# Altium schematic sheet POWER_STAGE.SchDoc: Power
size 420 x 297 mm; Author: G.Kasprowicz; CompanyName: WUT ISE; DrawnBy: G.Kasprowicz; Organization: WUT ISE; Address1: PW ISE; Address2: Nowowiejska 15/19 00-665 Warsaw; Address3: gkasprow@gmail.com; DocumentNumber: 8; Revision: 2; SheetNumber: 8; SheetTotal: 10; ModifiedBy: -; CheckedDate: -; Title2: Stage; DivGrp: WUT ISE; Designer: G.Kasprowicz; ModifiedDate: -; ProjectName: Sensor Box
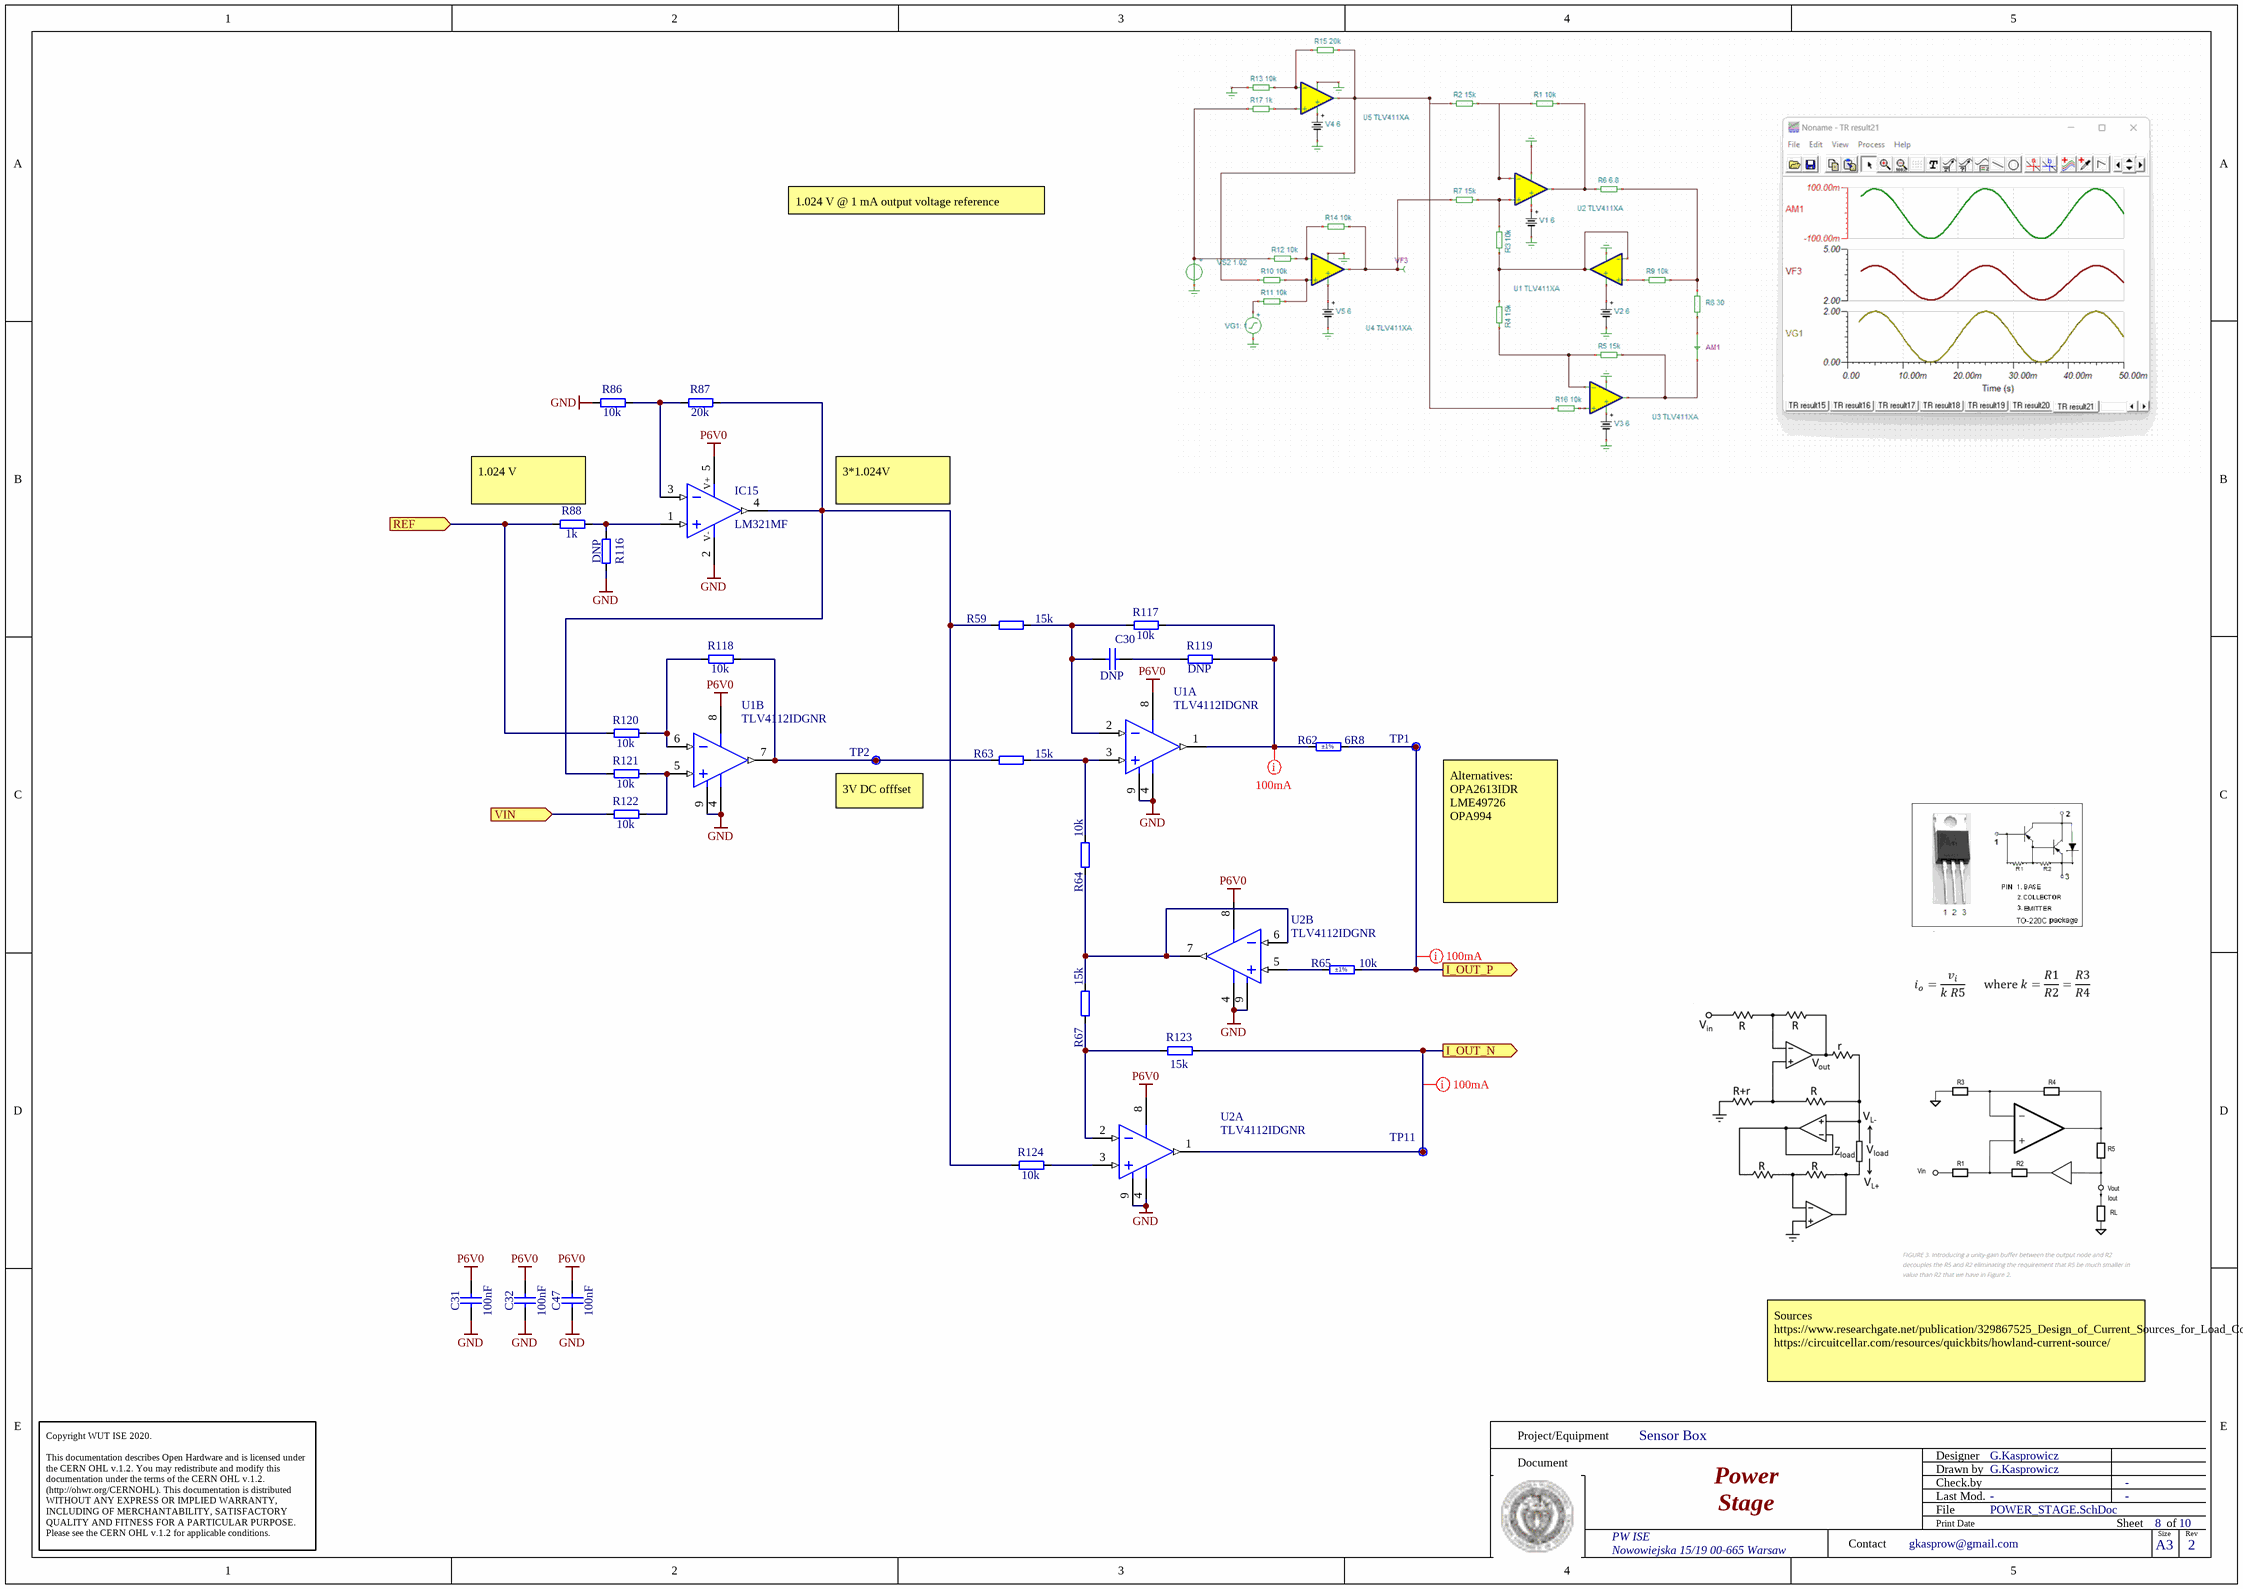
[diagram p0: POWER_STAGE.SchDoc]

## Parts
C30  DNP  [CAPC1005X55N]
C31  100nF  [CAPC1005X55N]
C32  100nF  [CAPC1005X55N]
C47  100nF  [CAPC1005X55N]
IC15  LM321MF  [SOT95P280X145-5N]
R59  15k  [RESC1005X40N]
R62  6R8  Tolerance: ±1%  [RESC6331X70N]
R63  15k  [RESC1005X40N]
R64  10k  [RESC1005X40N]
R65  10k  Tolerance: ±1%  [RESC1005X40N]
R67  15k  [RESC1005X40N]
R86  10k  [RESC1005X40N]
R87  20k  [RESC1005X40N]
R88  1k  [RESC1005X40N]
R116  DNP  [RESC1005X40N]
R117  10k  [RESC1005X40N]
R118  10k  [RESC1005X40N]
R119  DNP  [RESC1005X40N]
R120  10k  [RESC1005X40N]
R121  10k  [RESC1005X40N]
R122  10k  [RESC1005X40N]
R123  15k  [RESC1005X40N]
R124  10k  [RESC1005X40N]
TP1  Plated Hole  [c130h60]  (value not drawn)  (no BOM)
TP2  Plated Hole  [c130h60]  (value not drawn)  (no BOM)
TP11  Plated Hole  [c130h60]  (value not drawn)  (no BOM)
U1  TLV4112IDGNR  [DGN0008D_N]  (parts A,B of 2)
U2  TLV4112IDGNR  [DGN0008D_N]  (parts A,B of 2)

## Ports
I_OUT_N (out), I_OUT_P (out), REF (in), VIN (in)

## Nets
GND: C31.1 C32.1 C47.1 IC15.2(V-) R86.1 R116.2 U1.4(GND) U1.9(EP) U2.4(GND) U2.9(EP)
P6V0: C31.2 C32.2 C47.2 IC15.5(V+) U1.8(VDD+) U2.8(VDD+)
I_OUT_N: R123.2 TP11.1 U2.1(OUT1) ; port I_OUT_N
I_OUT_P: R62.2 R65.2 TP1.1 ; port I_OUT_P
REF: R88.1 R120.1 ; port REF
VIN: R122.1 ; port VIN
NetC30_1: C30.1 R59.2 R117.1 U1.2(IN1-)
NetC30_2: C30.2 R119.1
NetIC15_1: IC15.1(IN+) R88.2 R116.1
NetIC15_3: IC15.3(IN-) R86.2 R87.1
NetIC15_4: IC15.4(OUT) R59.1 R87.2 R121.1 R124.1
NetR62_1: R62.1 R117.2 R119.2 U1.1(OUT1)
NetR63_1: R63.1 R118.2 TP2.1 U1.7(OUT2)
NetR63_2: R63.2 R64.1 U1.3(IN1+)
NetR64_2: R64.2 R67.2 U2.6(IN2-) U2.7(OUT2)
NetR65_1: R65.1 U2.5(IN2+)
NetR67_1: R67.1 R123.1 U2.2(IN1-)
NetR118_1: R118.1 R120.2 U1.6(IN2-)
NetR121_2: R121.2 R122.2 U1.5(IN2+)
NetR124_2: R124.2 U2.3(IN1+)

## Layout directives
mark named 100mA: I_OUT_N, I_OUT_P, NetR62_1

## Notes on the sheet
- 1.024 V @ 1 mA output voltage reference
- (near R88) 1.024 V
- 3*1.024V
- (near TP2) 3V DC offfset
- (near TP1) Alternatives:
  OPA2613IDR
  LME49726
  OPA994
- Sources https://www.researchgate.net/publication/329867525_Design_of_Current_Sources_for_Load_Common_Mode_Optimization/figures?lo=1
  https://circuitcellar.com/resources/quickbits/howland-current-source/
- Project/Equipment
- Document
- Designer
- Drawn by
- Check.by
- Copyright WUT ISE 2020.
  This documentation describes Open Hardware and is licensed under the CERN OHL v.1.2. You may redistribute and modify this documentation under the terms of the CERN OHL v.1.2. (http://ohwr.org/CERNOHL). This documentation is distributed WITHOUT ANY EXPRESS OR IMPLIED WARRANTY, INCLUDING OF MERCHANTABILITY, SATISFACTORY QUALITY AND FITNESS FOR A PARTICULAR PURPOSE. Please see the CERN OHL v.1.2 for applicable conditions.
- Contact
- File
- Last Mod.
- Print Date
- Sheet
- Size
- A3
- of
- Rev

## Library data of the parts
C30 = CC0402_100NF_16V_10%_X5R: Non-polarised capacitor; Part Description: SMD Multilayer Chip Ceramic Capacitor; Manufacturer: GENERIC; Manufacturer1 Part Number: GRM155R61C104KA88D; Value: 100nF; Voltage: 16V; TC: X5R; Tolerance: ±10%; Part Number: CC0402_100NF_16V_10%_X5R; Component Kind: Standard; Component Type: Standard; Pin Count: 2; Status: None; Manufacturer Part Number: CC0402_100NF_16V_10%_X5R; Case: 0402; Mounted: Yes; Socket: No; SMD: Yes; Sense: No; Manufacturer1 Example: MURATA; Manufacturer1 ComponentHeight: 0.55mm; HelpURL: \\cern.ch\dfs\Applications\Altium\Datasheets\CC0402_X5R_MURATA_GRM.pdf; Author: CERN DEM JLC; CreateDate: 10.12.2013; LatestRevisionDate: 10.12.2013
C31 C32 C47 = CC0402_100NF_16V_10%_X5R: Non-polarised capacitor; Part Description: SMD Multilayer Chip Ceramic Capacitor; Manufacturer: GENERIC; Manufacturer1 Part Number: GRM155R61C104KA88D; Voltage: 16V; TC: X5R; Tolerance: ±10%; Part Number: CC0402_100NF_16V_10%_X5R; Component Kind: Standard; Component Type: Standard; Pin Count: 2; Value: 100nF; Status: None; Manufacturer Part Number: CC0402_100NF_16V_10%_X5R; Case: 0402; Mounted: Yes; Socket: No; SMD: Yes; Sense: No; Manufacturer1 Example: MURATA; Manufacturer1 ComponentHeight: 0.55mm; HelpURL: \\cern.ch\dfs\Applications\Altium\Datasheets\CC0402_X5R_MURATA_GRM.pdf; Author: CERN DEM JLC; CreateDate: 10.12.2013; LatestRevisionDate: 10.12.2013
IC15 = LM321MF/NOPB: Low Power Single Operational Amplifier; Manufacturer: TEXAS INSTRUMENTS; PressFit: No; Bonding: No; Part Number: LM321MF/NOPB; Component Kind: Standard; Component Type: Standard; Device: LM321MF; PackageDescription: SOT, 0.95mm Pitch; 5 Pin, 1.60mm W X 2.90mm L X 1.45mm H body, IPC Medium Density; Part Description: Low Power Single Operational Amplifier; Manufacturer Part Number: LM321MF; Pin Count: 5; Case: SOT23-5; Mounted: Yes; Socket: No; SMD: Yes; Sense: No; ComponentHeight: 1.45mm; Author: CERN DEM BC; HelpURL: \\cern.ch\dfs\Applications\Altium\Datasheets\LM321MF-NOPB.pdf; CreateDate: 04/09/2015; LatestRevisionDate: 01/06/2022
R59 R63 R67 R123 = R0402_15K_1%_0.0625W_100PPM: Resistor - 1%; Part Description: General Purpose Thick Film Chip Resistor; Manufacturer: GENERIC; Manufacturer1 Part Number: CRCW040215K0FK; TC: ±100ppm/°C; PressFit: No; Part Number: R0402_15K_1%_0.0625W_100PPM; Component Kind: Standard; Component Type: Standard; Pin Count: 2; Value: 15k; Sense: No; Power: 0.0625W; Tolerance: ±1%; Manufacturer Part Number: R0402_15K_1%_0.0625W_100PPM; Case: 0402; Mounted: Yes; Socket: No; SMD: Yes; HelpURL: \\cern.ch\dfs\Applications\Altium\Datasheets\R0402_VISHAY_CRCW e3.pdf; Author: CERN DEM JMW; CreateDate: 06/07/2015; LatestRevisionDate: 06/07/2015; Status: Preferred; Manufacturer1 Example: VISHAY; Manufacturer1 ComponentHeight: 0.4mm
R62 = R2512_6R8_1%_1W_200PPM: Resistor - 1%; Part Description: Thick Film Chip Resistor; Manufacturer: GENERIC; Manufacturer1 Part Number: 232276366808L or RC2512FK-076R8L; Power: 1W; TC: ±200ppm/°C; PressFit: No; Part Number: R2512_6R8_1%_1W_200PPM; Component Kind: Standard; Component Type: Standard; Pin Count: 2; Value: 6R8; Status: Preferred; Manufacturer Part Number: R2512_6R8_1%_1W_200PPM; Case: 2512; Mounted: Yes; Sense: No; Socket: No; SMD: Yes; HelpURL: \\cern.ch\dfs\Applications\Altium\Datasheets\R2512_Phycomp_RC2512.pdf; Author: CERN DEM JLC; CreateDate: 21/07/2008; LatestRevisionDate: 17/10/2012; Manufacturer1 Example: YAGEO PHYCOMP; Manufacturer1 ComponentHeight: 0.65mm
R64 R86 R117 R118 R120-R122 R124 = R0402_10K_1%_0.0625W_100PPM: Resistor - 1%; Part Description: General Purpose Thick Film Chip Resistor; Manufacturer: GENERIC; Manufacturer1 Part Number: 232270671003L; TC: ±100ppm/°C; PressFit: No; Part Number: R0402_10K_1%_0.0625W_100PPM; Component Kind: Standard; Component Type: Standard; Pin Count: 2; Value: 10k; Sense: No; Power: 0.0625W; Tolerance: ±1%; Manufacturer Part Number: R0402_10K_1%_0.0625W_100PPM; Case: 0402; Mounted: Yes; Socket: No; SMD: Yes; HelpURL: \\cern.ch\dfs\Applications\Altium\Datasheets\R0402_Phycomp_RC0402.pdf; Author: CERN DEM JLC; CreateDate: 03/12/2007; LatestRevisionDate: 17/10/2012; Status: Not Recommended; Manufacturer1 Example: YAGEO PHYCOMP; Manufacturer1 ComponentHeight: 0.4mm
R65 = R0402_10K_1%_0.0625W_100PPM: Resistor - 1%; Part Description: General Purpose Thick Film Chip Resistor; Manufacturer: GENERIC; Manufacturer1 Part Number: 232270671003L; PressFit: No; TC: ±100ppm/°C; Part Number: R0402_10K_1%_0.0625W_100PPM; Component Kind: Standard; Component Type: Standard; Pin Count: 2; Value: 10k; Status: Not Recommended; Manufacturer Part Number: R0402_10K_1%_0.0625W_100PPM; Case: 0402; Mounted: Yes; Sense: No; Socket: No; SMD: Yes; Manufacturer1 Example: YAGEO PHYCOMP; Manufacturer1 ComponentHeight: 0.4mm; HelpURL: \\cern.ch\dfs\Applications\Altium\Datasheets\R0402_Phycomp_RC0402.pdf; Author: CERN DEM JLC; CreateDate: 03/12/2007; LatestRevisionDate: 17/10/2012; Power: 0.0625W
R87 R88 R116 R119 = R0402_10K_1%_0.0625W_100PPM: Resistor - 1%; Part Description: General Purpose Thick Film Chip Resistor; Manufacturer: GENERIC; Manufacturer1 Part Number: 232270671003L; Value: 10k; TC: ±100ppm/°C; PressFit: No; Part Number: R0402_10K_1%_0.0625W_100PPM; Component Kind: Standard; Component Type: Standard; Pin Count: 2; Sense: No; Power: 0.0625W; Tolerance: ±1%; Manufacturer Part Number: R0402_10K_1%_0.0625W_100PPM; Case: 0402; Mounted: Yes; Socket: No; SMD: Yes; HelpURL: \\cern.ch\dfs\Applications\Altium\Datasheets\R0402_Phycomp_RC0402.pdf; Author: CERN DEM JLC; CreateDate: 03/12/2007; LatestRevisionDate: 17/10/2012; Status: Not Recommended; Manufacturer1 Example: YAGEO PHYCOMP; Manufacturer1 ComponentHeight: 0.4mm
TP1 TP2 TP11 = PLATED_HOLE0.6_PAD1.3: Single Terminal Socket; Part Description: Plated Through Hole: Hole Dia.=0.6mm Pad Dia.=1.3mm; Mounted: No; Part Number: PLATED_HOLE0.6_PAD1.3; Component Type: Standard (No BOM); Pin Count: 1; Family: Plated Hole; Socket: No; SMD: No; Sense: No; Status: None; ComponentHeight: 0mm; HelpURL: Undefined; Author: CERN DEM MR; CreateDate: 02/03/2016; LatestRevisionDate: 02/03/2016; PackageDescription: Plated Through Hole: Hole Dia.=0.6mm Pad Dia.=1.3mm
U1 U2 = CMP-0272-01268-3: High-Output-Drive Operational Amplifier, 2.5 to 6 V, -40 to 125 degC, 8-pin SOP (DGN8), Green (RoHS & no Sb/Br); Manufacturer: Texas Instruments; Total Supply Voltage(Min)(+5V is 5, +/-5V is 10): 2.5; Total Supply Voltage(Max)(+5V is 5, +/-5V is 10): 6; Offset Drift(Typ)(uV/C): 3; Sub Family: Low Supply Voltage Amplifier (<=2.7V), Precision Amplifier; Vio (25C)(Max)(mV): 3.5; Iq per channel(Max)(mA): 1; IIB(Max)(pA): 50; Slew Rate(Typ)(V/us): 1.57; Number of Channels: 2; CMRR(Min)(dB): 63; Vn at 1kHz(Typ)(nV/rtHz): 20; Eco-Plan: Green (RoHS & no Sb/Br); ComponentLink2URL: http://www.ti.com/general/docs/lit/getliterature.tsp?genericPartNumber=TLV4112&fileType=pdf; PartNumber: TLV4112IDGNR; PackageReference: DGN0008D; DatasheetVersion: SLOS289E; ComponentLink3Description: Package Specification; Code_JEDEC: MO-187; ComponentLink1Description: Manufacturer URL; ComponentLink1URL: http://www.ti.com/; PackageDescription: 8-Pin Plastic Small Outline, Body 3 x 3 mm, Pitch 0.65 mm; ComponentLink3URL: http://www.ti.com/litv/pdf/mpds046e; ComponentLink2Description: Datasheet; PackageVersion: 4073271/F, 05/2011; Mounting Technology: Surface Mount